# EAGLE design ledDisplay (EAGLE 8.3.2)

## Sheet 1 of 2
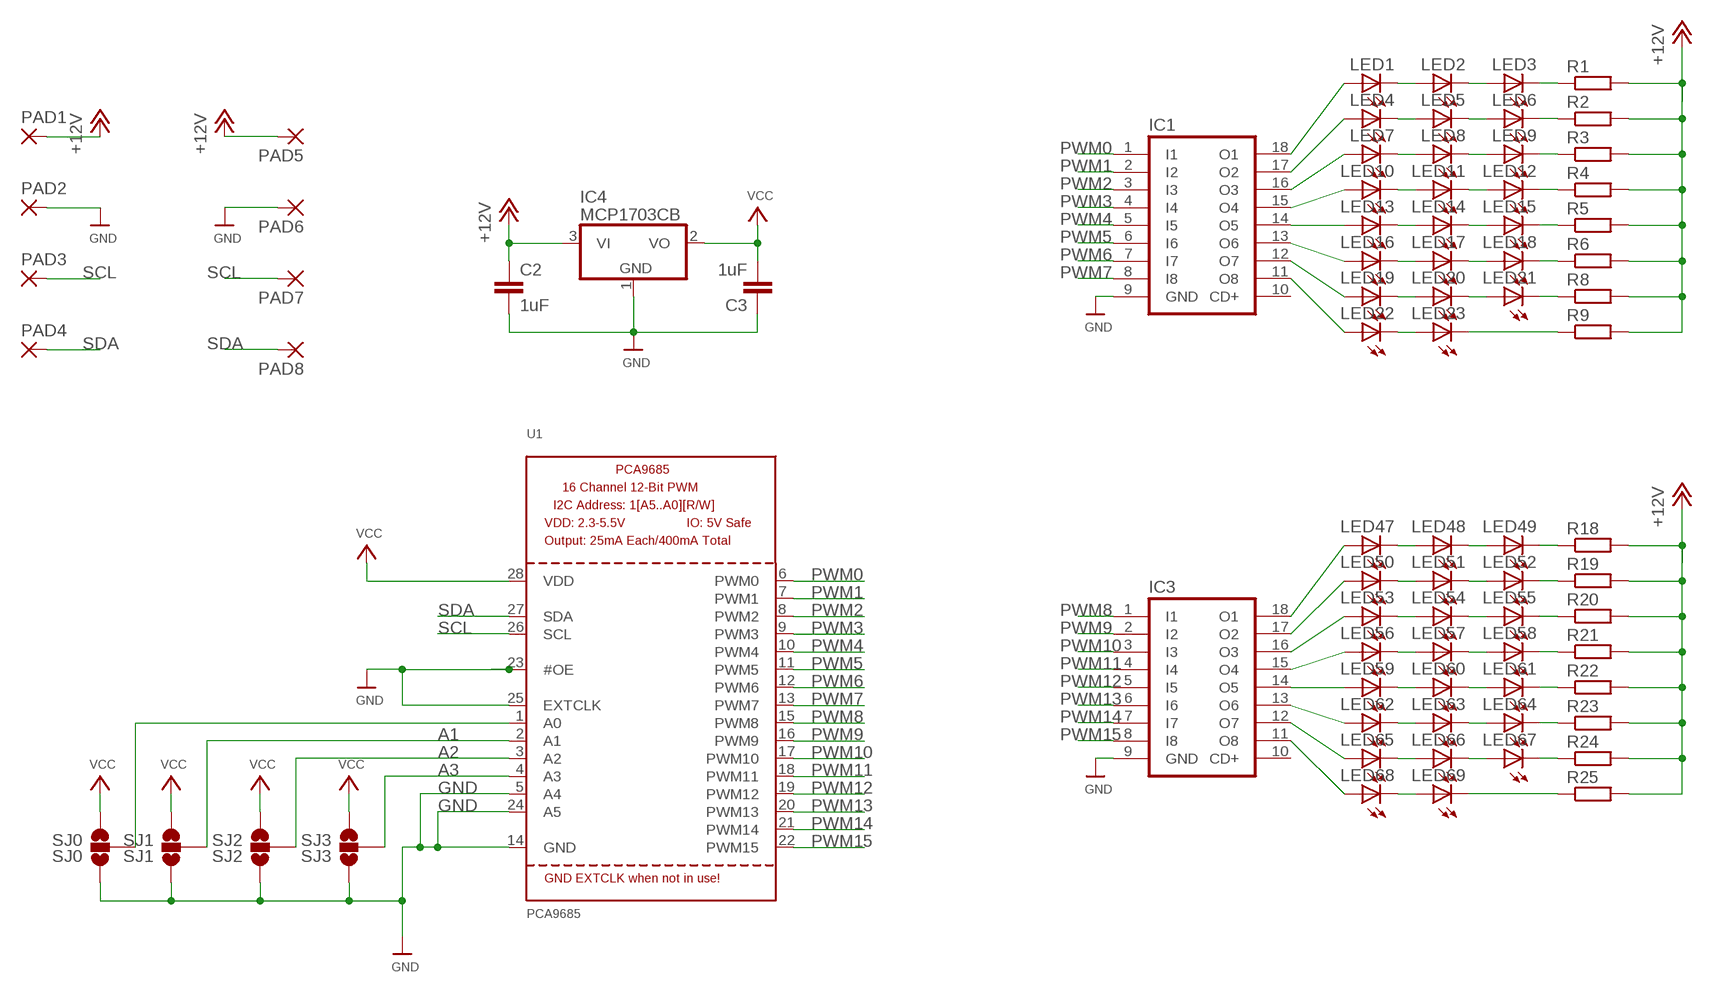
[diagram p0: schematic, sheet 1]

### Parts
C2  1uF  C-EUC1206  [C1206]
C3  1uF  C-EUC1206  [C1206]
IC1  ULN2803A  [SO18W]
IC3  ULN2803AIC  [DIL18]
IC4  MCP1703CB  [SOT23]
LED1  LED5MM  [LED5MM]
LED2  LED5MM  [LED5MM]
LED3  LED5MM  [LED5MM]
LED4  LED5MM  [LED5MM]
LED5  LED5MM  [LED5MM]
LED6  LED5MM  [LED5MM]
LED7  LED5MM  [LED5MM]
LED8  LED5MM  [LED5MM]
LED9  LED5MM  [LED5MM]
LED10  LED5MM  [LED5MM]
LED11  LED5MM  [LED5MM]
LED12  LED5MM  [LED5MM]
LED13  LED5MM  [LED5MM]
LED14  LED5MM  [LED5MM]
LED15  LED5MM  [LED5MM]
LED16  LED5MM  [LED5MM]
LED17  LED5MM  [LED5MM]
LED18  LED5MM  [LED5MM]
LED19  LED5MM  [LED5MM]
LED20  LED5MM  [LED5MM]
LED21  LED5MM  [LED5MM]
LED22  LED5MM  [LED5MM]
LED23  LED5MM  [LED5MM]
LED47  LED5MM  [LED5MM]
LED48  LED5MM  [LED5MM]
LED49  LED5MM  [LED5MM]
LED50  LED5MM  [LED5MM]
LED51  LED5MM  [LED5MM]
LED52  LED5MM  [LED5MM]
LED53  LED5MM  [LED5MM]
LED54  LED5MM  [LED5MM]
LED55  LED5MM  [LED5MM]
LED56  LED5MM  [LED5MM]
LED57  LED5MM  [LED5MM]
LED58  LED5MM  [LED5MM]
LED59  LED5MM  [LED5MM]
LED60  LED5MM  [LED5MM]
LED61  LED5MM  [LED5MM]
LED62  LED5MM  [LED5MM]
LED63  LED5MM  [LED5MM]
LED64  LED5MM  [LED5MM]
LED65  LED5MM  [LED5MM]
LED66  LED5MM  [LED5MM]
LED67  LED5MM  [LED5MM]
LED68  LED5MM  [LED5MM]
LED69  LED5MM  [LED5MM]
PAD1  SMD5  [SMD2,54-5,08]
PAD2  SMD5  [SMD2,54-5,08]
PAD3  SMD5  [SMD2,54-5,08]
PAD4  SMD5  [SMD2,54-5,08]
PAD5  SMD5  [SMD2,54-5,08]
PAD6  SMD5  [SMD2,54-5,08]
PAD7  SMD5  [SMD2,54-5,08]
PAD8  SMD5  [SMD2,54-5,08]
R1  R-EU_0204/7  [0204/7]
R2  R-EU_0204/7  [0204/7]
R3  R-EU_0204/7  [0204/7]
R4  R-EU_0204/7  [0204/7]
R5  R-EU_0204/7  [0204/7]
R6  R-EU_0204/7  [0204/7]
R8  R-EU_0204/7  [0204/7]
R9  R-EU_0204/7  [0204/7]
R18  R-EU_0204/7  [0204/7]
R19  R-EU_0204/7  [0204/7]
R20  R-EU_0204/7  [0204/7]
R21  R-EU_0204/7  [0204/7]
R22  R-EU_0204/7  [0204/7]
R23  R-EU_0204/7  [0204/7]
R24  R-EU_0204/7  [0204/7]
R25  R-EU_0204/7  [0204/7]
SJ0  SJ0  SOLDERJUMPER_2WAYS  [SJ_3]
SJ1  SJ1  SOLDERJUMPER_2WAYS  [SJ_3]
SJ2  SJ2  SOLDERJUMPER_2WAYS  [SJ_3]
SJ3  SJ3  SOLDERJUMPER_2WAYS  [SJ_3]
U1  PCA9685  [TSSOP28]

### Nets
+12V: C2.1 IC4.3(VI) PAD1.1(P) PAD5.1(P) R1.2 R2.2 R3.2 R4.2 R5.2 R6.2 R8.2 R9.2 R18.2 R19.2 R20.2 R21.2 R22.2 R23.2 R24.2 R25.2
A1: SJ1.2 U1.2(A1)
A2: SJ2.2 U1.3(A2)
A3: SJ3.2 U1.4(A3)
GND: C2.2 C3.1 IC1.9(GND) IC3.9(GND) IC4.1(GND) PAD2.1(P) PAD6.1(P) SJ0.1 SJ1.1 SJ2.1 SJ3.1 U1.5(A4) U1.14(GND) U1.23(#OE) U1.24(A5) U1.25(EXTCLK)
N$1: LED1.K(C) LED2.A
N$2: LED2.K(C) LED3.A
N$3: IC1.18(O1) LED1.A
N$4: LED3.K(C) R1.1
N$5: LED7.K(C) LED8.A
N$6: LED4.K(C) LED5.A
N$7: LED5.K(C) LED6.A
N$8: IC1.17(O2) LED4.A
N$9: LED6.K(C) R2.1
N$10: LED13.K(C) LED14.A
N$11: LED8.K(C) LED9.A
N$12: LED9.K(C) R3.1
N$13: LED14.K(C) LED15.A
N$14: LED10.K(C) LED11.A
N$15: LED11.K(C) LED12.A
N$16: LED12.K(C) R4.1
N$17: LED15.K(C) R5.1
N$18: IC1.16(O3) LED7.A
N$19: IC1.15(O4) LED10.A
N$20: IC1.14(O5) LED13.A
N$21: LED16.K(C) LED17.A
N$22: LED17.K(C) LED18.A
N$23: LED18.K(C) R6.1
N$24: IC1.13(O6) LED16.A
N$25: LED19.K(C) LED20.A
N$26: LED20.K(C) LED21.A
N$27: LED21.K(C) R8.1
N$28: IC1.12(O7) LED19.A
N$29: LED22.K(C) LED23.A
N$30: LED23.K(C) R9.1
N$32: IC1.11(O8) LED22.A
N$64: LED47.K(C) LED48.A
N$65: SJ0.2 U1.1(A0)
N$66: LED48.K(C) LED49.A
N$67: IC3.18(O1) LED47.A
N$68: LED49.K(C) R18.1
N$69: LED50.K(C) LED51.A
N$70: LED51.K(C) LED52.A
N$71: IC3.17(O2) LED50.A
N$72: LED52.K(C) R19.1
N$73: LED53.K(C) LED54.A
N$74: LED54.K(C) LED55.A
N$75: LED55.K(C) R20.1
N$76: LED56.K(C) LED57.A
N$77: LED57.K(C) LED58.A
N$78: LED58.K(C) R21.1
N$79: IC3.16(O3) LED53.A
N$80: IC3.15(O4) LED56.A
N$81: LED59.K(C) LED60.A
N$82: LED60.K(C) LED61.A
N$83: LED61.K(C) R22.1
N$84: LED62.K(C) LED63.A
N$85: LED63.K(C) LED64.A
N$86: LED64.K(C) R23.1
N$87: IC3.14(O5) LED59.A
N$88: IC3.13(O6) LED62.A
N$89: LED65.K(C) LED66.A
N$90: LED66.K(C) LED67.A
N$91: LED67.K(C) R24.1
N$92: LED68.K(C) LED69.A
N$93: IC3.12(O7) LED65.A
N$94: IC3.11(O8) LED68.A
N$95: LED69.K(C) R25.1
PWM0: IC1.1(I1) U1.6(PWM0)
PWM1: IC1.2(I2) U1.7(PWM1)
PWM2: IC1.3(I3) U1.8(PWM2)
PWM3: IC1.4(I4) U1.9(PWM3)
PWM4: IC1.5(I5) U1.10(PWM4)
PWM5: IC1.6(I6) U1.11(PWM5)
PWM6: IC1.7(I7) U1.12(PWM6)
PWM7: IC1.8(I8) U1.13(PWM7)
PWM8: IC3.1(I1) U1.15(PWM8)
PWM9: IC3.2(I2) U1.16(PWM9)
PWM10: IC3.3(I3) U1.17(PWM10)
PWM11: IC3.4(I4) U1.18(PWM11)
PWM12: IC3.5(I5) U1.19(PWM12)
PWM13: IC3.6(I6) U1.20(PWM13)
PWM14: IC3.7(I7) U1.21(PWM14)
PWM15: IC3.8(I8) U1.22(PWM15)
SCL: PAD3.1(P) PAD7.1(P) U1.26(SCL)
SDA: PAD4.1(P) PAD8.1(P) U1.27(SDA)
VCC: C3.2 IC4.2(VO) SJ0.3 SJ1.3 SJ2.3 SJ3.3 U1.28(VDD)
Unconnected: IC1.10(CD+) IC3.10(CD+)

## Sheet 2 of 2

## Library data of the parts
C2 C3 = rcl:C-EU: CAPACITOR, European symbol
IC1 IC3 = lpatiny:ULN2803A: DRIVER ARRAY
IC4 = linear:MCP1703: 250 mA, 16V, Low Quiescent Current LDO Regulator Source: http://ww1.microchip.com/downloads/en/DeviceDoc/22049b.pdf
LED1-LED23 LED47-LED69 = led:LED: LED OSRAM: - CHIPLED LG R971, LG N971, LY N971, LG Q971, LY Q971, LO R971, LY R971 LH N974, LH R974 LS Q976, LO Q976, LY Q976 LO Q996 - Hyper CHIPLED LW Q18S LB Q993, LB Q99A, LB R99A - SideLED LS A670, LO A670, LY A670, LG A670, LP A670 LB A673, LV A673, LT A673, LW A673 LH A674 LY A675 LS A676, LA A676, LO A676, LY A676, LW A676 LS A679, LY A679, LG A679 - Hyper Micro SIDELED® LS Y876, LA Y876, LO Y876, LY Y876 LT Y87S - SmartLED LW L88C, LW L88S LB L89C, LB L89S, LG L890 LS L89K, LO L89K, LY L89K LS L896, LA L896, LO L896, LY L896 - TOPLED LS T670, LO T670, LY T670, LG T670, LP T670 LSG T670, LSP T670, LSY T670, LOP T670, LYG T670 LG T671, LOG T671, LSG T671 LB T673, LV T673, LT T673, LW T673 LH T674 LS T676, LA T676, LO T676, LY T676, LB T676, LH T676, LSB T676, LW T676 LB T67C, LV T67C, LT T67C, LS T67K, LO T67K, LY T67K, LW E67C LS E67B, LA E67B, LO E67B, LY E67B, LB E67C, LV E67C, LT E67C LW T67C LS T679, LY T679, LG T679 LS T770, LO T770, LY T770, LG T770, LP T770 LB T773, LV T773, LT T773, LW T773 LH T774 LS E675, LA E675, LY E675, LS T675 LS T776, LA T776, LO T776, LY T776, LB T776 LHGB T686 LT T68C, LB T68C - Hyper Mini TOPLED® LB M676 - Mini TOPLED Santana® LG M470 LS M47K, LO M47K, LY M47K Source: http://www.osram.convergy.de LUXEON: - LUMILED® LXK2-PW12-R00, LXK2-PW12-S00, LXK2-PW14-U00, LXK2-PW14-V00 LXK2-PM12-R00, LXK2-PM12-S00, LXK2-PM14-U00 LXK2-PE12-Q00, LXK2-PE12-R00, LXK2-PE12-S00, LXK2-PE14-T00, LXK2-PE14-U00 LXK2-PB12-K00, LXK2-PB12-L00, LXK2-PB12-M00, LXK2-PB14-N00, LXK2-PB14-P00, LXK2-PB14-Q00 LXK2-PR12-L00, LXK2-PR12-M00, LXK2-PR14-Q00, LXK2-PR14-R00 LXK2-PD12-Q00, LXK2-PD12-R00, LXK2-PD12-S00 LXK2-PH12-R00, LXK2-PH12-S00 LXK2-PL12-P00, LXK2-PL12-Q00, LXK2-PL12-R00 Source: www.luxeon.com KINGBRIGHT: KA-3528ASYC Source: www.kingbright.com
PAD1-PAD8 = wirepad:SMD5: SMD PAD
R1-R6 R8 R9 R18-R25 = rcl:R-EU_: RESISTOR, European symbol
SJ0 SJ1-SJ3 = SparkFun:SOLDERJUMPER_2WAY: Solder Jumper 2 way solder jumper
U1 = microbuilder:PCA9685: PCA9685 - 16 Channel 12-Bit I2C PWM Controller 5.0V tolerant 16 channel, 12-bit I2C PWM controller with 25mA per output (max. 400mA total) Digikey: 568-5931-1-ND

## Board
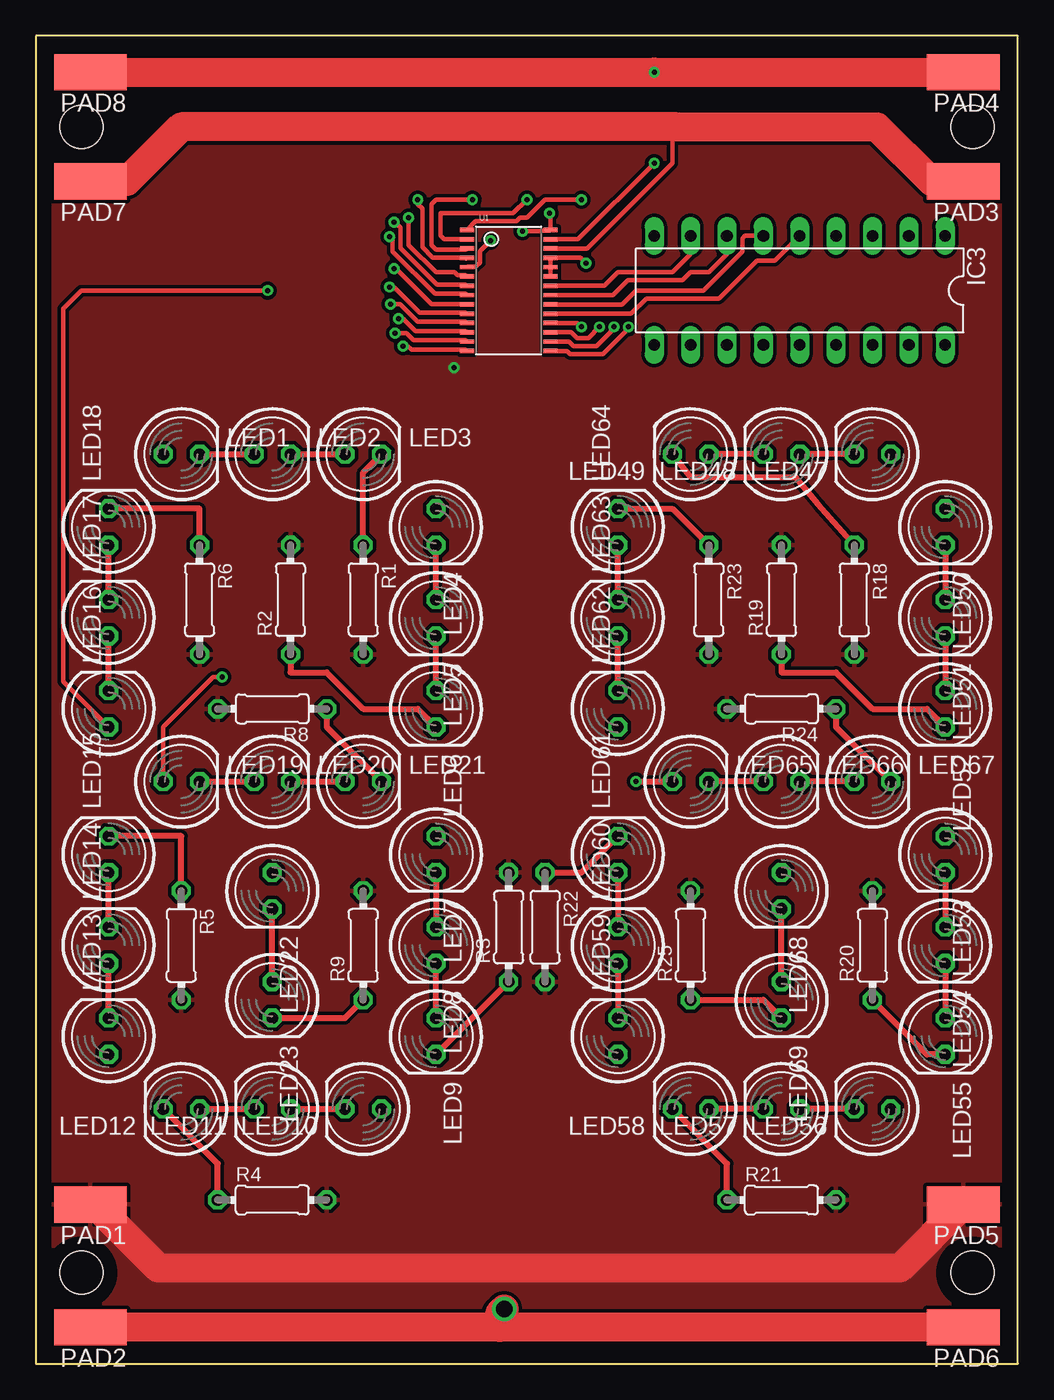
[diagram p1: board, top side]
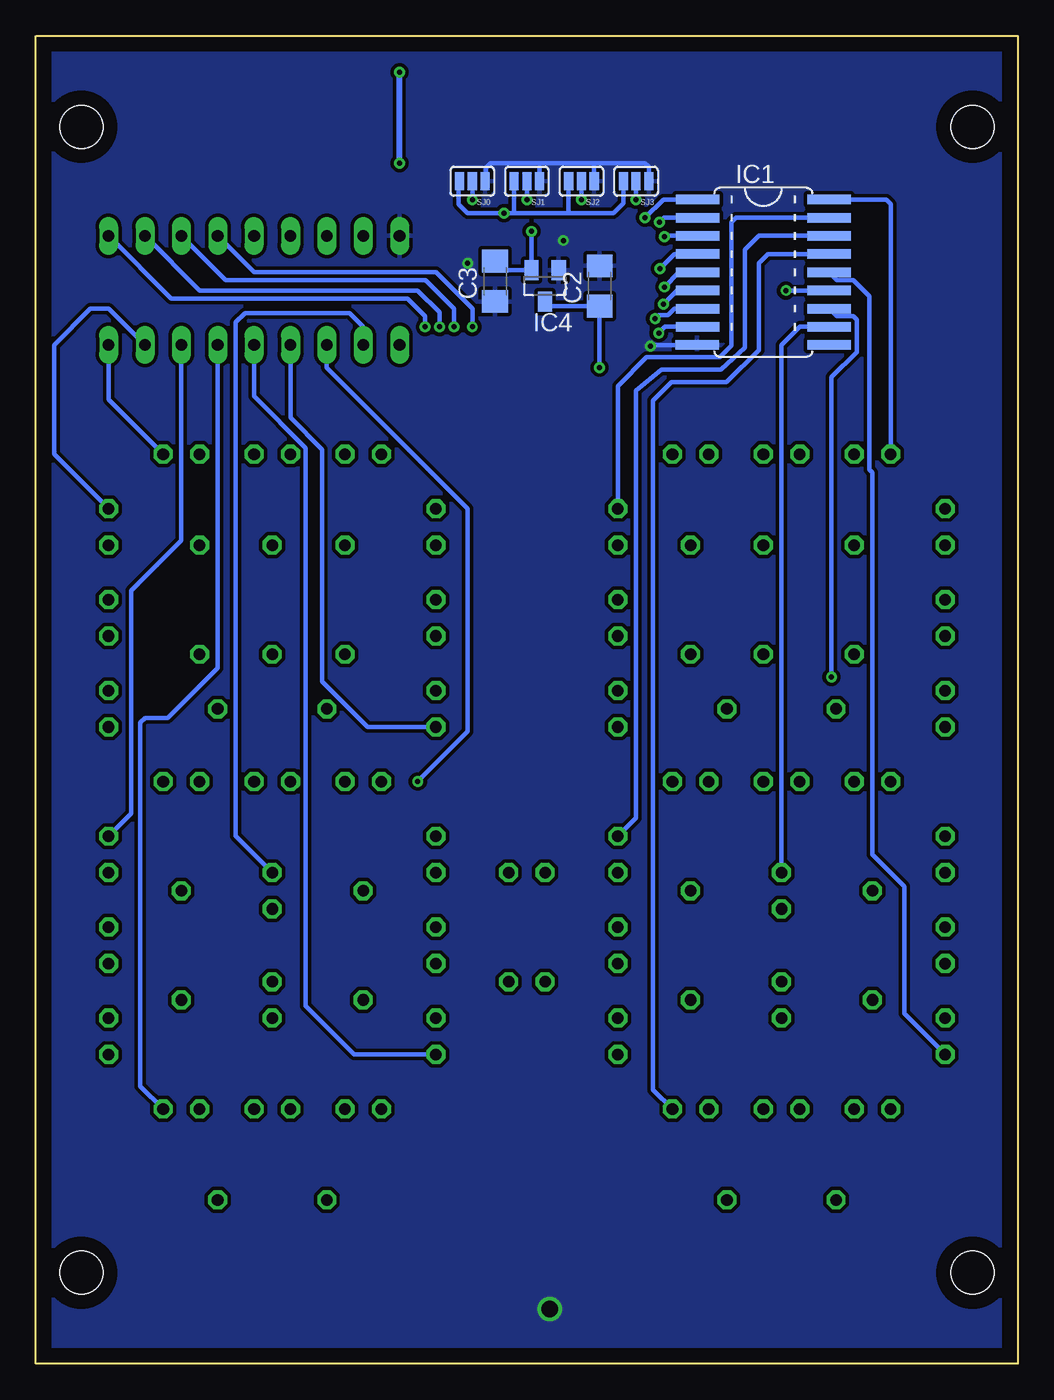
[diagram p2: board, bottom side, seen from below]

Size 68.58 x 92.71 mm. Coordinates in mm from the lower left corner, seen from the top.
Outline: 0,0 68.58,0 68.58,92.71 0,92.71 0,0
Copper layers (1*16): Top 0.035mm / dielectric 1.5mm / Bottom 0.035mm
Design rules "default *": minimum track width 10mil, minimum drill 0.35mm, track to track 10mil, track to pad 10mil, pad to pad 10mil, via to via 10mil, smd to smd 10mil, copper to edge 40mil, drill to drill 10mil, minimum pad ring 10mil, minimum via ring 8mil, stop-mask expansion 4mil, vias tented up to drill 0mil, thermal gap 10mil
Holes 3 mm at 3.17,86.36 65.41,86.36 3.17,6.35 65.41,6.35

### Footprints (pad centres in the part's own frame; a part is rotated, then mirrored left to right if it is on the bottom)
C1206 = smd 1.6 x 1.8: 1 -1.4,0; 2 1.4,0
SO18W = smd 0.66 x 3.048: 1 -5.08,-4.585; 2 -3.81,-4.585; 3 -2.54,-4.585; 4 -1.27,-4.585; 5 0,-4.585; 6 1.27,-4.585; 7 2.54,-4.585; 8 3.81,-4.585; 9 5.08,-4.623; 10 5.08,4.585; 11 3.81,4.585; 12 2.54,4.585; 13 1.27,4.585; 14 0,4.585; 15 -1.27,4.585; 16 -2.54,4.585; 17 -3.81,4.585; 18 -5.08,4.585
DIL18 = drill 0.813 long: 1 -10.16,-3.81; 2 -7.62,-3.81; 3 -5.08,-3.81; 4 -2.54,-3.81; 5 0,-3.81; 6 2.54,-3.81; 7 5.08,-3.81; 8 7.62,-3.81; 9 10.16,-3.81; 10 10.16,3.81; 11 7.62,3.81; 12 5.08,3.81; 13 2.54,3.81; 14 0,3.81; 15 -2.54,3.81; 16 -5.08,3.81; 17 -7.62,3.81; 18 -10.16,3.81
SOT23 = smd 1 x 1.4: 1 -0.95,-1.1; 2 0.95,-1.1; 3 0,1.1
LED5MM = drill 0.813 octagon: A -1.27,0; K 1.27,0
SMD2,54-5,08 = smd 2.54 x 5.08: 1 0,0
0204/7 = drill 0.813 octagon: 1 -3.81,0; 2 3.81,0
SJ_3 = smd 0.635 x 1.27: 1 -0.889,0; 2 0,0; 3 0.889,0
TSSOP28 = smd 0.305 x 0.991: 1 -4.225,-2.918; 2 -3.575,-2.918; 3 -2.925,-2.918; 4 -2.275,-2.918; 5 -1.625,-2.918; 6 -0.975,-2.918; 7 -0.325,-2.918; 8 0.325,-2.918; 9 0.975,-2.918; 10 1.625,-2.918; 11 2.275,-2.918; 12 2.925,-2.918; 13 3.575,-2.918; 14 4.225,-2.918; 15 4.225,2.918; 16 3.575,2.918; 17 2.925,2.918; 18 2.275,2.918; 19 1.625,2.918; 20 0.975,2.918; 21 0.325,2.918; 22 -0.325,2.918; 23 -0.975,2.918; 24 -1.625,2.918; 25 -2.275,2.918; 26 -2.925,2.918; 27 -3.575,2.918; 28 -4.225,2.918

### Placement (x,y rotation side)
C2  29.21,75.25 90 bottom
C3  36.51,75.56 90 bottom
IC1  17.78,76.2 270 bottom
IC3  53.34,74.93 180 top
IC4  33.02,75.25 180 bottom
LED1  10.16,63.5 0 top
LED2  16.51,63.5 0 top
LED3  22.86,63.5 0 top
LED4  27.94,58.42 270 top
LED5  27.94,52.07 270 top
LED6  27.94,45.72 270 top
LED7  27.94,35.56 270 top
LED8  27.94,29.21 270 top
LED9  27.94,22.86 270 top
LED10  22.86,17.78 180 top
LED11  16.51,17.78 180 top
LED12  10.16,17.78 180 top
LED13  5.08,22.86 90 top
LED14  5.08,29.21 90 top
LED15  5.08,35.56 90 top
LED16  5.08,45.72 90 top
LED17  5.08,52.07 90 top
LED18  5.08,58.42 90 top
LED19  10.16,40.64 0 top
LED20  16.51,40.64 0 top
LED21  22.86,40.64 0 top
LED22  16.51,33.02 270 top
LED23  16.51,25.4 270 top
LED47  58.42,63.5 180 top
LED48  52.07,63.5 180 top
LED49  45.72,63.5 180 top
LED50  63.5,58.42 270 top
LED51  63.5,52.07 270 top
LED52  63.5,45.72 270 top
LED53  63.5,35.56 270 top
LED54  63.5,29.21 270 top
LED55  63.5,22.86 270 top
LED56  58.42,17.78 180 top
LED57  52.07,17.78 180 top
LED58  45.72,17.78 180 top
LED59  40.64,22.86 90 top
LED60  40.64,29.21 90 top
LED61  40.64,35.56 90 top
LED62  40.64,45.72 90 top
LED63  40.64,52.07 90 top
LED64  40.64,58.42 90 top
LED65  45.72,40.64 0 top
LED66  52.07,40.64 0 top
LED67  58.42,40.64 0 top
LED68  52.07,33.02 270 top
LED69  52.07,25.4 270 top
PAD1  3.81,11.11 90 top
PAD2  3.81,2.54 90 top
PAD3  64.77,82.55 90 top
PAD4  64.77,90.17 90 top
PAD5  64.77,11.11 90 top
PAD6  64.77,2.54 90 top
PAD7  3.81,82.55 90 top
PAD8  3.81,90.17 90 top
R1  22.86,53.34 270 top
R2  17.78,53.34 90 top
R3  33.02,30.48 90 top
R4  16.51,11.43 0 top
R5  10.16,29.21 270 top
R6  11.43,53.34 270 top
R8  16.51,45.72 180 top
R9  22.86,29.21 90 top
R18  57.15,53.34 270 top
R19  52.07,53.34 90 top
R20  58.42,29.21 90 top
R21  52.07,11.43 0 top
R22  35.56,30.48 270 top
R23  46.99,53.34 270 top
R24  52.07,45.72 180 top
R25  45.72,29.21 90 top
SJ0  38.1,82.55 180 bottom
SJ1  34.29,82.55 180 bottom
SJ2  30.48,82.55 180 bottom
SJ3  26.67,82.55 180 bottom
U1  33.02,74.93 270 top

### Tracks (layer width: path | path; a pad name or v marks a point on that pad's centre or on a via)
+12V  (via drill 0.35)
  Top 2.032: PAD1.1 4.13,11.11 8.57,6.67 60.33,6.67 PAD5.1
  Bottom 0.305: IC4.3 32.72,73.85 C2.1 v29.21,69.53
  pour Top: -1.27,93.98 -1.27,-1.91 69.85,-1.91 69.85,93.98 -0.95,93.98
A1  (via drill 0.35)
  Top 0.305: U1.2 28.49,78.5 28.26,78.74 28.26,80.33 33.34,80.33 v34.29,81.28
  Bottom 0.305: v34.29,81.28 SJ1.2
A2  (via drill 0.35)
  Top 0.305: v30.48,81.28 27.94,81.28 27.62,80.96 27.62,78.11 27.94,77.79 30.04,77.79 U1.3
  Bottom 0.305: SJ2.2 v30.48,81.28
A3  (via drill 0.35)
  Top 0.305: U1.4 30.05,77.15 29.97,77.23 27.71,77.23 26.99,77.94 26.99,80.64 26.67,80.96 v26.67,81.28
  Bottom 0.305: SJ3.2 v26.67,81.28
GND  (via drill 0.35, 1.14)
  Top 0.305: v25.65,71.06 25.97,71.06 26.23,70.8 30.01,70.8 U1.14 | U1.23 U1.24 U1.25 38.05,77.2 v38.42,76.83 | v31.75,78.42 31,77.68 31,76.88 30.71,76.59 30.14,76.59 U1.5
  Top 2.032: 32.38,2.54 PAD2.1 | 32.38,2.54 32.38,3.49 v32.7,3.81 | PAD6.1 32.38,2.54
  Bottom 0.305: SJ3.1 25.78,83.57 26.04,83.82 29.53,83.82 | 33.34,83.82 29.53,83.82 | 33.34,83.82 36.83,83.82 37.15,83.5 37.15,82.61 SJ0.1 | SJ2.1 29.59,83.76 29.53,83.82 | SJ1.1 33.4,83.76 33.34,83.82 | IC1.9 25.59,71.12 v25.65,71.06
  pour Bottom: -0.95,93.66 69.53,93.66 69.53,-1.27 -0.95,-1.27
N$1
  Top 0.406: LED1.K LED2.A
N$2
  Top 0.406: LED2.K LED3.A
N$3
  Bottom 0.305: IC1.18 9.21,81.28 8.89,80.96 LED1.A
N$4
  Top 0.406: R1.1 22.86,62.23 LED3.K
N$5
  Top 0.406: LED7.K LED8.A
N$6
  Top 0.406: LED5.A LED4.K
N$7
  Top 0.406: LED6.A LED5.K
N$8
  Bottom 0.305: IC1.17 19.68,80.01 20,79.69 20,71.09 20.82,70.27 25.93,70.27 27.94,68.26 LED4.A
N$9
  Top 0.406: R2.1 17.78,48.26 20.32,48.26 22.86,45.72 26.67,45.72 LED6.K
N$10
  Top 0.406: LED13.K LED14.A
N$11
  Top 0.406: LED9.A LED8.K
N$12
  Top 0.406: R3.1 LED9.K
N$13
  Top 0.406: LED14.K LED15.A
N$14
  Top 0.406: LED11.A LED10.K
N$15
  Top 0.406: LED12.A LED11.K
N$16
  Top 0.406: R4.1 12.7,13.97 LED12.K
N$17
  Top 0.406: R5.1 10.16,36.83 LED15.K
N$18
  Bottom 0.305: IC1.16 18.1,78.74 19.05,77.79 19.05,70.94 20.75,69.39 24.9,69.39 26.67,67.94 26.67,38.1 LED7.A
N$19
  Bottom 0.305: IC1.15 17.46,77.47 18.1,76.83 18.1,70.78 20.36,68.52 24.19,68.52 25.48,67.23 25.48,19.13 LED10.A
N$20
  Bottom 0.305: IC1.14 12.66,75.67 11.5,75.67 10.36,74.53 10.36,62.43 10.16,62.23 10.16,35.56 7.94,33.34 7.94,24.45 LED13.A
N$21
  Top 0.406: LED16.K LED17.A
N$22
  Top 0.406: LED17.K LED18.A
N$23
  Top 0.406: R6.1 11.43,59.69 LED18.K
N$24  (via drill 0.35)
  Top 0.305: v16.19,74.93 3.17,74.93 1.91,73.66 1.91,47.62 LED16.A
  Bottom 0.305: IC1.13 v16.19,74.93
N$25
  Top 0.406: LED19.K LED20.A
N$26
  Top 0.406: LED20.K LED21.A
N$27
  Top 0.406: R8.1 20.32,44.45 LED21.K
N$28  (via drill 0.35)
  Top 0.305: v13.02,47.94 12.38,47.94 8.89,44.45 LED19.A
  Bottom 0.305: IC1.12 12.66,73.13 11.5,73.13 11.27,72.89 11.27,70.62 13.02,68.87 v13.02,47.94
N$29
  Top 0.406: LED23.A LED22.K
N$30
  Top 0.406: LED23.K 21.59,24.13 R9.1
N$32
  Bottom 0.305: IC1.11 15.24,72.39 16.51,71.12 LED22.A
N$64
  Top 0.406: LED47.K LED48.A
N$65  (via drill 0.35)
  Top 0.305: v38.1,81.28 35.56,81.28 34.29,80.01 33.81,80.01 33.57,79.77 30.72,79.77 U1.1
  Bottom 0.305: SJ0.2 v38.1,81.28
N$66
  Top 0.406: LED48.K LED49.A
N$67
  Bottom 0.305: IC3.18 63.5,67.31 LED47.A
N$68
  Top 0.406: LED49.K 45.72,61.91 53.02,61.91 54.61,60.01 R18.1
N$69
  Top 0.406: LED50.K LED51.A
N$70
  Top 0.406: LED51.K LED52.A
N$71
  Bottom 0.305: IC3.17 63.5,73.66 64.77,73.66 67.31,71.12 67.31,63.5 LED50.A
N$72
  Top 0.406: R19.1 52.07,48.26 55.88,48.26 58.42,45.72 62.23,45.72 LED52.K
N$73
  Top 0.406: LED53.K LED54.A
N$74
  Top 0.406: LED54.K LED55.A
N$75
  Top 0.406: LED55.K 62.23,21.59 R20.1
N$76
  Top 0.406: LED56.K LED57.A
N$77
  Top 0.406: LED57.K LED58.A
N$78
  Top 0.406: R21.1 48.26,13.97 LED58.K
N$79
  Bottom 0.305: IC3.16 58.42,57.47 61.91,53.98 61.91,38.42 LED53.A
N$80
  Bottom 0.305: IC3.15 55.88,48.58 59.37,45.09 60.96,45.09 61.28,44.77 61.28,19.37 LED56.A
N$81
  Top 0.406: LED60.A LED59.K
N$82
  Top 0.406: LED61.A LED60.K
N$83
  Top 0.406: R22.1 38.1,34.29 LED61.K
N$84
  Top 0.406: LED62.K LED63.A
N$85
  Top 0.406: LED63.K LED64.A
N$86
  Top 0.406: LED64.K 44.45,59.69 R23.1
N$87
  Bottom 0.305: IC3.14 53.34,67.55 49.73,63.94 49.73,24.97 46.35,21.59 LED59.A
N$88
  Bottom 0.305: IC3.13 50.8,66.04 48.58,63.82 48.58,47.62 45.4,44.45 LED62.A
N$89
  Top 0.406: LED66.A LED65.K
N$90
  Top 0.406: LED67.A LED66.K
N$91
  Top 0.406: R24.1 55.88,44.45 LED67.K
N$92
  Top 0.406: LED69.A LED68.K
N$93  (via drill 0.35)
  Top 0.406: v41.91,40.64 LED65.A
  Bottom 0.305: IC3.12 48.26,69.53 38.42,59.69 38.42,44.13 v41.91,40.64
N$94
  Bottom 0.305: IC3.11 45.72,72.39 46.67,73.34 53.98,73.34 54.61,72.71 54.61,36.83 LED68.A
N$95
  Top 0.406: R25.1 50.8,25.4 LED69.K
PWM0  (via drill 0.35)
  Top 0.305: v26.04,80.01 26.04,78.11 27.94,76.2 29.23,76.2 29.44,76 30.01,76 U1.6
  Bottom 0.305: IC1.1 24.77,81.28 v26.04,80.01
PWM1  (via drill 0.35)
  Top 0.305: v25.02,79.69 25.08,79.69 25.48,79.3 25.48,77.87 28,75.35 30.01,75.35 U1.7
  Bottom 0.305: IC1.2 24.71,80.01 v25.02,79.69
PWM2  (via drill 0.35)
  Top 0.305: U1.8 30.01,74.7 27.86,74.7 24.92,77.64 24.92,78.46 v24.69,78.68
  Bottom 0.305: IC1.3 24.63,78.74 v24.69,78.68
PWM3  (via drill 0.35)
  Top 0.305: v25.01,76.44 25.16,76.44 27.62,73.98 30.08,73.98 U1.9
  Bottom 0.305: IC1.4 23.98,77.47 v25.01,76.44
PWM4  (via drill 0.35)
  Top 0.305: v24.69,75.18 25.01,75.18 26.79,73.4 30.01,73.4 U1.10
  Bottom 0.305: IC1.5 23.67,76.2 v24.69,75.18
PWM5  (via drill 0.35)
  Top 0.305: v24.77,73.98 25.42,73.98 26.65,72.75 30.01,72.75 U1.11
  Bottom 0.305: IC1.6 23.81,74.93 v24.77,73.98
PWM6  (via drill 0.35)
  Top 0.305: v25.33,72.96 25.65,72.96 26.51,72.1 30.01,72.1 U1.12
  Bottom 0.305: IC1.7 23.97,73.66 24.44,73.19 25.1,73.19 v25.33,72.96
PWM7  (via drill 0.35)
  Top 0.305: v25.08,71.95 25.87,71.95 26.37,71.45 30.01,71.45 U1.13
  Bottom 0.305: IC1.8 24.64,72.39 v25.08,71.95
PWM8  (via drill 0.35)
  Top 0.305: U1.15 37.09,70.7 37.31,70.49 39.59,70.49 41.16,72.06 41.16,72.16 v41.39,72.39
  Bottom 0.305: v41.39,72.39 41.39,73.14 42.62,74.37 59.13,74.37 IC3.1
PWM9  (via drill 0.35)
  Top 0.305: U1.16 37.23,71.36 37.54,71.05 39.14,71.05 40.16,72.06 40.16,72.16 v40.38,72.39
  Bottom 0.305: v40.38,72.39 40.38,73.4 41.91,74.93 57.15,74.93 IC3.2
PWM10  (via drill 0.35)
  Top 0.305: U1.17 37.38,72 37.77,71.61 38.59,71.61 v39.37,72.39
  Bottom 0.305: v39.37,72.39 39.37,73.66 41.35,75.64 55.32,75.64 IC3.3
PWM11  (via drill 0.35)
  Top 0.305: U1.18 37.84,72.66 v38.1,72.39
  Bottom 0.305: v38.1,72.39 38.1,73.66 40.64,76.2 53.34,76.2 IC3.4
PWM12
  Top 0.305: U1.19 41.55,73.31 42.62,74.37 47.7,74.37 50.35,77.02 50.36,77.01 51.61,77.01 IC3.5
PWM13
  Top 0.305: U1.20 40.94,73.95 41.91,74.93 46.62,74.93 49.33,77.64 49.33,78.54 49.53,78.74 IC3.6
PWM14
  Top 0.305: U1.21 40.31,74.61 41.35,75.64 45.16,75.64 45.72,76.2 46.99,76.2 48.26,77.47 IC3.7
PWM15
  Top 0.305: U1.22 39.7,75.25 40.64,76.2 44.45,76.2 45.72,77.47 IC3.8
SCL
  Top 0.305: U1.26 38.48,77.86 44.45,83.82 44.45,86.04 44.77,86.36
  Top 2.032: PAD7.1 6.35,82.55 10.16,86.36 44.77,86.36 58.74,86.36 62.55,82.55 PAD3.1
SDA  (via drill 0.35)
  Top 0.305: U1.27 37.87,78.5 v43.18,83.82
  Top 2.032: PAD8.1 v43.18,90.17 PAD4.1
  Bottom 0.406: v43.18,83.82 v43.18,90.17
VCC  (via drill 0.35)
  Top 0.305: v35.88,80.33 35.94,80.27 U1.28 35.9,79.11 35.33,79.11 35.27,79.06 v33.97,79.06
  Bottom 0.305: SJ3.3 27.56,81.03 28.26,80.33 31.43,80.33 | SJ0.3 39.05,82.49 39.05,80.96 38.42,80.33 v35.88,80.33 35.24,80.33 | 31.43,80.33 35.24,80.33 | SJ1.3 35.18,80.39 35.24,80.33 | SJ2.3 31.37,80.39 31.43,80.33 | C3.2 35.9,76.35 IC4.2 v33.97,79.06

### Text on the board
tValues: SDA | SDA | SCL | SCL | +12V | LED DISPLAY v1.0 | +12V | GND | GND
bValues: LEDS ARE INVERTED !!!!!!